# Altium schematic sheet NODE MCU ESP12.SchDoc
size A4
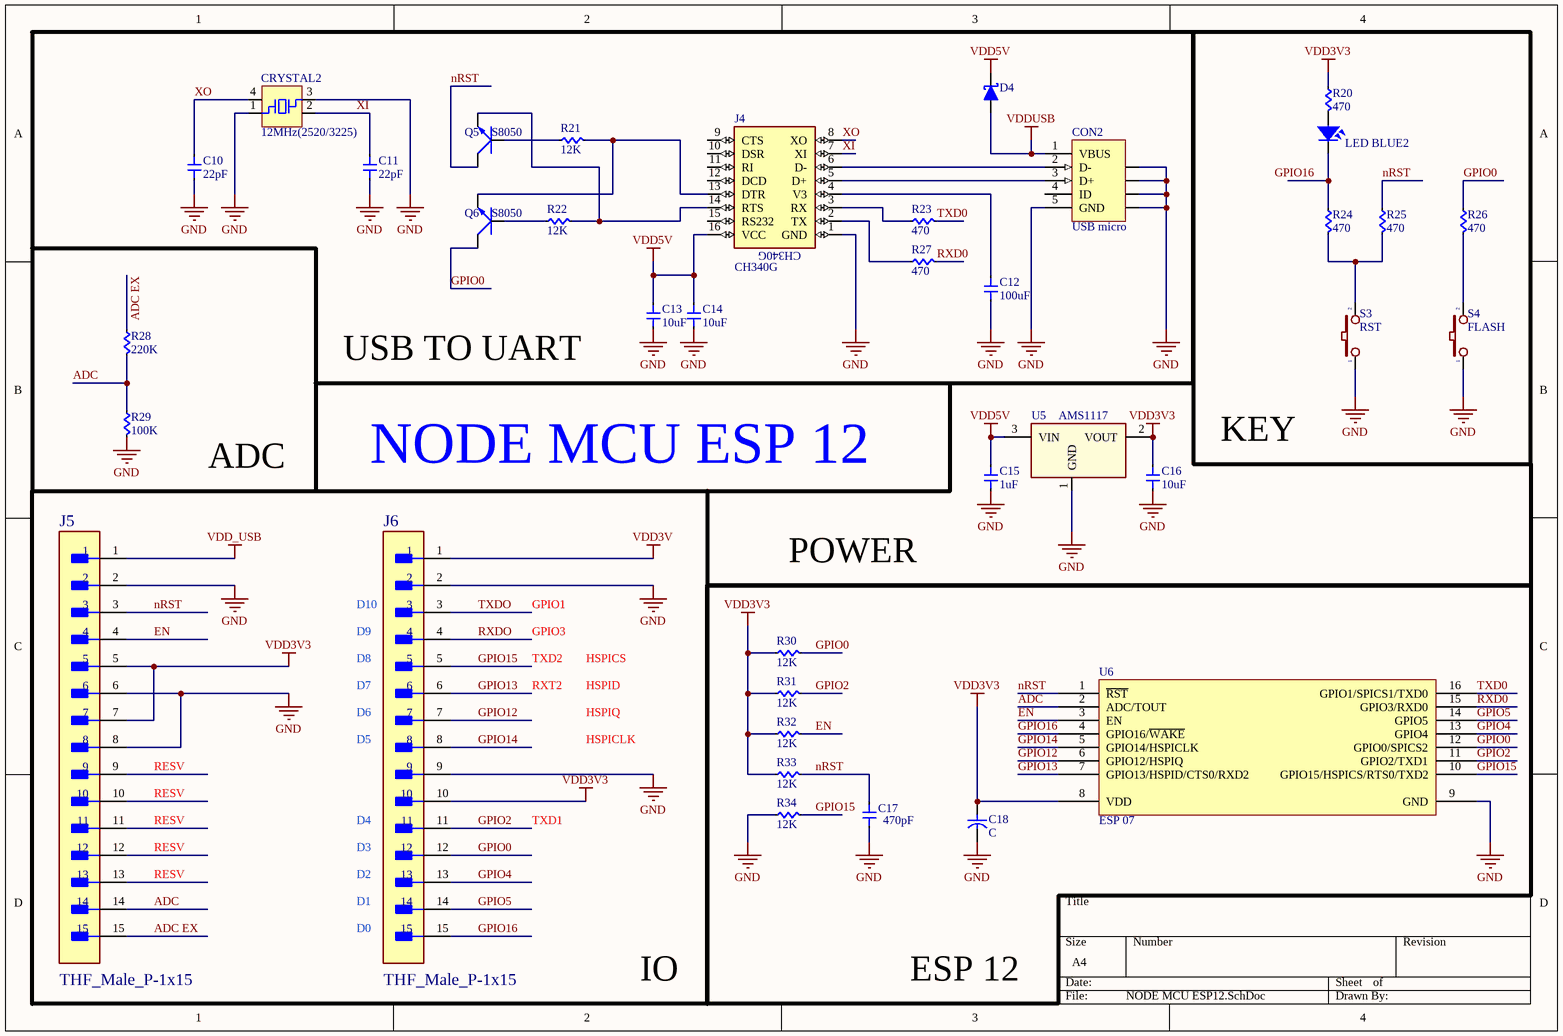
[diagram p0: NODE MCU ESP12.SchDoc]

## Parts
C10  22pF  [Cap 0201]
C11  22pF  [Cap 0201]
C12  100uF  [Cap 0201]
C13  10uF  [Cap 0201]
C14  10uF  [Cap 0201]
C15  1uF  [Cap 0201]
C16  10uF  [Cap 0201]
C17  470pF  [Cap 1210]
C18  C  [C SMD TAN 1210 (B)]
CON2  USB micro  [CONN/USB/MICRO/RA]
CRYSTAL2  12MHz(2520/3225)  [Crystal SMD 4PIN 32x25]
D4  (no value)  [DO-214AC (SMA)]
J4  CH340G  [SOIC-16]
J5  THF_Male_P-1x15  [FP-90121-0135-MFG]
J6  THF_Male_P-1x15  [FP-90121-0135-MFG]
LED_BLUE2  LED  [LED-5-BLUE]  (value not drawn)
Q5  S8050  [TO92]
Q6  S8050  [TO92]
R20  470  [RES 0402]
R21  12K  [RES 0402]
R22  12K  [RES 0402]
R23  470  [RES 0402]
R24  470  [RES 0402]
R25  470  [RES 0402]
R26  470  [RES 0402]
R27  470  [RES 0402]
R28  220K  [RES 0402]
R29  100K  [RES 0402]
R30  12K  [RES 0402]
R31  12K  [RES 0402]
R32  12K  [RES 0402]
R33  12K  [RES 0402]
R34  12K  [RES 0402]
S3  RST  [SW1-SMD]
S4  FLASH  [SW1-SMD]
U5  AMS1117  [SOT-223]
U6  ESP 07  [ESP8266 07]

## Blocks framed on the sheet
KEY: LED_BLUE2 R20 R24-R26 S3 S4
NODE MCU ESP 12: J5 J6

## Nets
GND: C10.1 C11.1 C12.1 C13.1 C14.1 C15.1 C16.1 C17.1 C18.2 CON2.5(GND) CON2.6(SHLD) CON2.7(SHLD) CON2.8(SHLD) CON2.9(SHLD) CRYSTAL2.1(XTAL) CRYSTAL2.3(XTAL) J4.1(GND) J5.2 J5.6 J5.8 J6.2 J6.9 R29.2 R34.1 S3.1 S4.1 U5.1(GND) U6.9(GND)
VDD3V: J6.1
VDD3V3: C16.2 C18.1 J5.5 J5.7 J6.10 R20.1 R30.1 R31.1 R32.1 R33.1 U5.2(VOUT) U6.8(VDD)
VDD5V: C13.2 C14.2 C15.2 D4.2(K) J4.16(VCC) U5.3(VIN)
VDD_USB: J5.1
VDDUSB: CON2.1(VBUS) D4.1(A)
ADC: J5.14 R28.2 R29.1 U6.2(ADC/TOUT)
ADC EX: J5.15 R28.1
EN: J5.4 R32.2 U6.3(EN)
GPIO0: J6.12 Q6.3(C) R26.1 R30.2 U6.12(GPIO0/SPICS2)
GPIO1: J6.3  [also labelled TXDO]
GPIO2: J6.11 R31.2 U6.11(GPIO2/TXD1)  [also labelled TXD1]
GPIO3: J6.4  [also labelled RXDO]
GPIO4: J6.13 U6.13(GPIO4)
GPIO5: J6.14 U6.14(GPIO5)
GPIO12: J6.7 U6.6(GPIO12/HSPIQ)
GPIO13: J6.6 U6.7(GPIO13/HSPID/CTS0/RXD2)  [also labelled RXT2]
GPIO14: J6.8 U6.5(GPIO14/HSPICLK)
GPIO15: J6.5 R34.2 U6.10(GPIO15/HSPICS/RTS0/TXD2)  [also labelled TXD2]
GPIO16: J6.15 U6.4(GPIO16/~{WAKE})
nRST: C17.2 J5.3 Q5.3(C) R25.1 R33.2 U6.1(~{RST})
RESV: J5.9 J5.10 J5.11 J5.12 J5.13
RXD0: R27.2 U6.15(GPIO3/RXD0)
TXD0: R23.2 U6.16(GPIO1/SPICS1/TXD0)
XI: C11.2 CRYSTAL2.2(GND) J4.7(XI)
XO: C10.2 CRYSTAL2.4(GND) J4.8(XO)
NetC12_2: C12.2 J4.4(V3)
NetCON2_2: CON2.2(D-) J4.6(D-)
NetCON2_3: CON2.3(D+) J4.5(D+)
NetJ4_2: J4.2(TX) R27.1
NetJ4_3: J4.3(RX) R23.1
NetJ4_13: J4.13(DTR) Q6.1(E) R21.2
NetJ4_14: J4.14(RTS) Q5.1(E) R22.2
NetLED_BLUE2_1: LED_BLUE2.1 R20.2
NetLED_BLUE2_2: LED_BLUE2.2 R24.1
NetQ5_2: Q5.2(B) R21.1
NetQ6_2: Q6.2(B) R22.1
NetR24_2: R24.2 R25.2 S3.2
NetR26_2: R26.2 S4.2

Not connected (* = marked no-connect by the designer): CON2 4(ID); J4 9(CTS) 10(DSR) 11(RI) 12(DCD) 15(RS232)

## Notes on the sheet
- USB TO UART
- ADC
- POWER
- IO
- ESP 12
- Labels drawn without touching a wire or pin: D0, D1, D2, D3, D4, D5, D6, D7, D8, D9, D10, GPIO16, HSPICLK, HSPICS, HSPID, HSPIQ

## Library data of the parts
C10-C16 = Cap 0201: Capacitor SMD 0201
C17 = Cap 1210: Capacitor SMD 1210
C18 = Capacitor: Capacitor pol
CON2 = CON USB micro: USB micro, 5 pins
CRYSTAL2 = Crystal 4pin
D4 = Diode Schottky: Schottky Diode
J4 = CH340G: USB Interface Integrated Circuit; MF: WCH; MP: Ch340G; Price: None; SnapEDA_Link: https://www.snapeda.com/parts/Ch340G/WCH/view-part/6287223/?ref=snap; Package: Package; Check_prices: https://www.snapeda.com/parts/Ch340G/WCH/view-part/6287223/?ref=eda; Value: *; Availability: No availability data
J5 J6 = CMP-04776-000526-1: CONN HEADER R/A 15POS 2.54MM; Number of Contacts: 15; Voltage Rating: 350V; Glow Wire Compliant: Non-compliant; Current Rating: 3A; Gender: Male; Number of Circuits: 15; Max Operating Temperature: 125°C; Packaging: Tray; Contact Plating: Tin; Package Quantity: 1800; Housing Material: Polyester; Number of Positions: 15; Number of Rows: 1; Pitch: 2.54mm; Series: 90121; Mount: Through Hole; Radiation Hardening: No; Contact Material: Brass; Min Operating Temperature: -55°C; Termination: Through Hole; RoHS Compliant: Yes; Orientation: Right Angle
LED_BLUE2 = LED: LED Single colour Green and Red; Value: LED 3 ly Single Colour
Q5 Q6 = Trans 2N3904: NPN transistor EBC; Value: C9014
R20-R34 = RES 0402: RES SMD 0402; Manufacturer: Vishay Dale; Manufacturer Part Number: CRCW040210K0FKED; Resistance (Ohms): 10k; Tolerance: ±1%; Power (Watts): 0.063W, 1/16W; Temperature Coefficient: ±100ppm/°C; Supplier 1: Digi-Key; RoHS: RoHS Compliant; Category: Resistors; Stock 1: 2392462; Pricing 1: 10=0.083, 50=0.0444, 200=0.0255, 1000=0.0174 (USD); Packaging: Cut Tape (CT); Composition: Thick Film; Features: Automotive AEC-Q200; Operating Temperature: -55°C ~ 155°C; Package / Case: 0402 (1005 Metric); Supplier Device Package: 0402 (1005 Metric); Size / Dimension: 0.039" L x 0.020" W (1.00mm x 0.50mm); Height: 0.016" (0.40mm); Number of Terminations: 2; ComponentLink1URL: http://www.vishay.com/docs/20035/dcrcwe3.pdf; ComponentLink1Description: http://www.vishay.com/docs/20035/dcrcwe3.pdf; Supplier Part Number 1: 541-10.0KLCT-ND
S3 S4 = SW2: Switch button 2 pin; Value: SW chip 2 pin
U5 = AMS1117: 1A LDO Voltage Regulator, ADJ or fixed 1.5/1.8/2.5/2.85/3.3/5V
U6 = ESP8266 07: ESP8266 07 16 Pin; IC: ESP8266-EX; Vendor: Ai-thinker